# Altium project Tesla Coil.PrjPcb
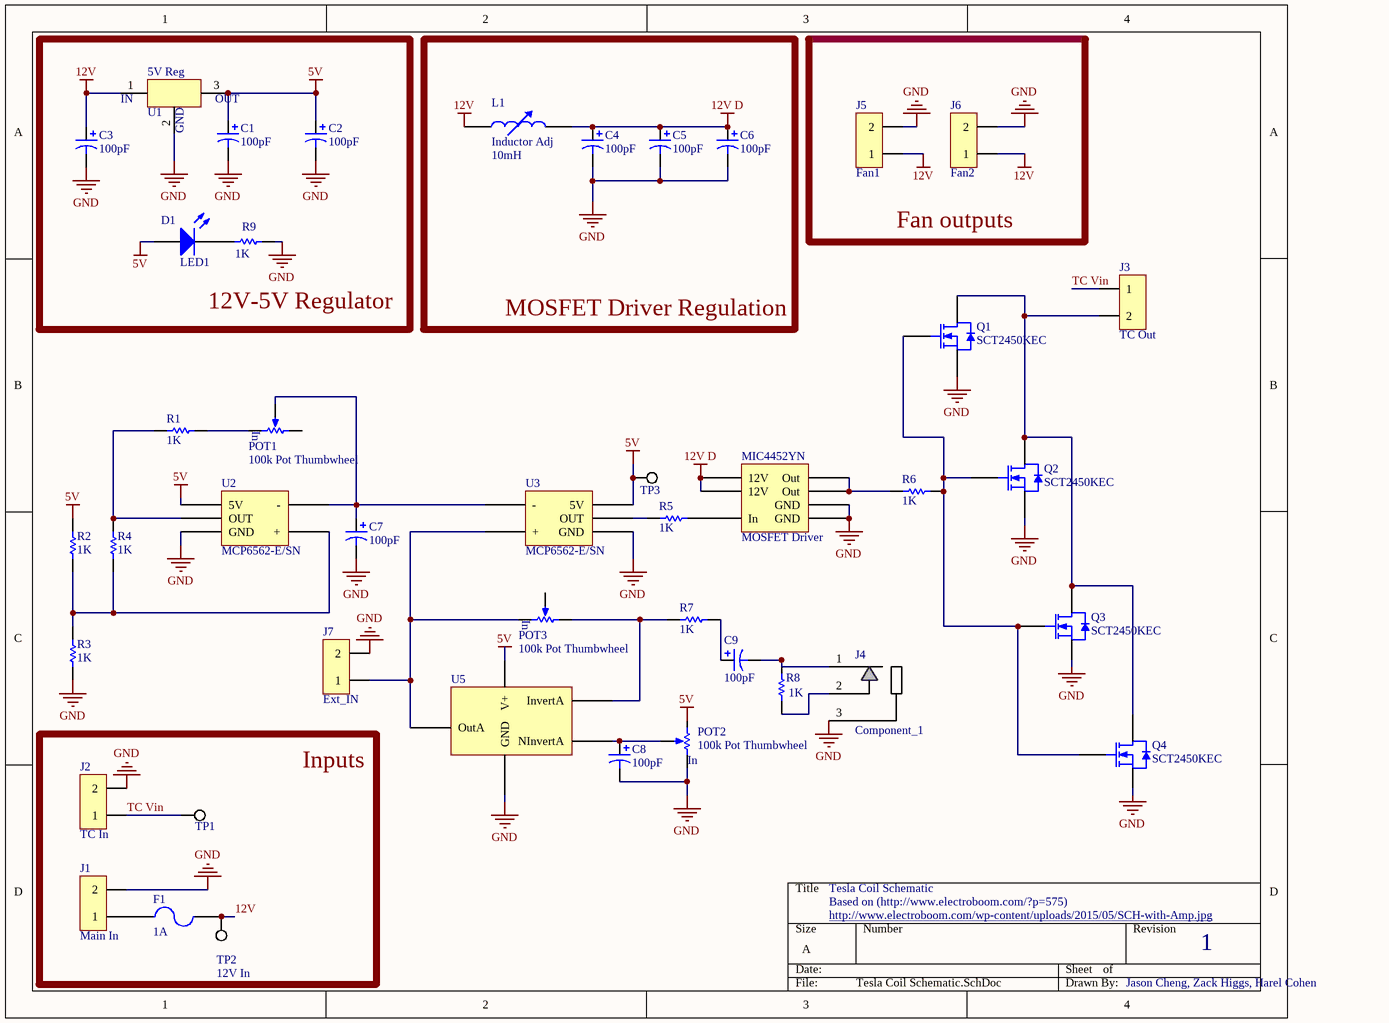
[diagram p0: Tesla Coil Schematic.SchDoc]
1 sheet, 43 parts. Net scope: global (net labels, ports and power ports of the same name join across sheets).
Board file: Tesla Coil PCB.PcbDoc

## Sheet Tesla Coil Schematic.SchDoc
size A

### Parts
C1  value 100pF  [CAPPR5-10X30]  (hidden comment: Cap 5-10x30)
C2  value 100pF  [CAPPR5-10X30]  (hidden comment: Cap 5-10x30)
C3  value 100pF  [CAPPR5-10X30]  (hidden comment: Cap 5-10x30)
C4  value 100pF  [CAPPR5-10X30]  (hidden comment: Cap 5-10x30)
C5  value 100pF  [CAPPR5-10X30]  (hidden comment: Cap 5-10x30)
C6  value 100pF  [CAPPR5-10X30]  (hidden comment: Cap 5-10x30)
C7  value 100pF  [CAPPR2-5X11]  (hidden comment: Cap 2-5x11)
C8  value 100pF  [CAPPR2-5X11]  (hidden comment: Cap 2-5x11)
C9  value 100pF  [CAPPR5-10X30]  (hidden comment: Cap 5-10x30)
D1  LED1  [LED-1]
F1  1A  [Blade Fuse]
J1  Main In  [Mini-Fit Jr. 2]
J2  TC In  [Mini-Fit Jr. 2]
J3  TC Out  [Mini-Fit Jr. 2]
J4  Component_1  [3.5Jack Foot]
J5  Fan1  [Mini-Fit Jr. 2]
J6  Fan2  [Mini-Fit Jr. 2]
J7  Ext_IN  [Mini-Fit Jr. 2]
L1  Inductor Adj  value 10mH  [AXIAL-0.8]
MIC4452YN  MOSFET Driver  [MIC441/44]
POT1  100k Pot Thumbwheel  [10K Pot 3352T]
POT2  100k Pot Thumbwheel  [10K Pot 3352T]
POT3  100k Pot Thumbwheel  [10K Pot 3352T]
Q1  SCT2450KEC  [SCT2450KEC]
Q2  SCT2450KEC  [SCT2450KEC]
Q3  SCT2450KEC  [SCT2450KEC]
Q4  SCT2450KEC  [SCT2450KEC]
R1  value 1K  [RES10.55-7X2.8]  (hidden comment: R Thru Hole)
R2  value 1K  [RES10.55-7X2.8]  (hidden comment: R Thru Hole)
R3  value 1K  [RES10.55-7X2.8]  (hidden comment: R Thru Hole)
R4  value 1K  [RES10.55-7X2.8]  (hidden comment: R Thru Hole)
R5  value 1K  [RES10.55-7X2.8]  (hidden comment: R Thru Hole)
R6  value 1K  [RES10.55-7X2.8]  (hidden comment: R Thru Hole)
R7  value 1K  [RES10.55-7X2.8]  (hidden comment: R Thru Hole)
R8  value 1K  [RES10.55-7X2.8]  (hidden comment: R Thru Hole)
R9  value 1K  [RES10.55-7X2.8]  (hidden comment: R Thru Hole)
TP1  Test Point  [Test Point]  (value not drawn)
TP2  Label: 12V In  [Test Point]  (hidden comment: Test Point)
TP3  Test Point  [Test Point]  (value not drawn)
U1  REG  [5V REG]  (value not drawn)
U2  MCP6562-E/SN  [MCP6562]
U3  MCP6562-E/SN  [MCP6562]
U5  LM358 (DIP Socket)  [3M5473-ND-]  (value not drawn)

### Blocks framed on the sheet
12V-5V Regulator: C1-C3 D1 R9 U1
MOSFET Driver Regulation: C4-C6 L1
Inputs: F1 J1 J2 TP1 TP2

### Nets
5V: C1.1 C2.1 D1.1(A) R2.2 TP3.1 U1.3 U2.5(5V) U3.8(5V) U5.8(V+)
12V: C3.1 F1.2 J5.1 J6.1 L1.1 TP2.1 U1.1
12V D: C4.1 C5.1 C6.1 L1.2 MIC4452YN.1(12V) MIC4452YN.8(12V)
GND: C1.2 C2.2 C3.2 C4.2 C5.2 C6.2 C7.2 C8.2 J1.2 J2.2 J4.3 J5.2 J6.2 J7.2 MIC4452YN.5(GND) MIC4452YN.6(GND) POT2.1(In) Q1.3 Q2.3 Q3.3 Q4.3 R3.1 R9.1 U1.2 U2.2(GND) U3.4(GND) U5.4(GND)
TC Vin: J2.1 J3.1 TP1.1
NetC7_1: C7.1 POT1.2(TAP) U2.4(-) U3.2(-)
NetC8_1: C8.1 POT2.2(TAP) U5.3(NInvertA)
NetC9_1: C9.1 R7.2
NetC9_2: C9.2 J4.1 R8.2
NetD1_2: D1.2(K) R9.2
NetF1_1: F1.1 J1.1
NetJ3_2: J3.2 Q1.2 Q2.2 Q3.2 Q4.2
NetJ4_2: J4.2 R8.1
NetJ7_1: J7.1 POT3.1(In) U3.3(+) U5.1(OutA)
NetMIC4452YN_2: MIC4452YN.2(In) R5.2
NetMIC4452YN_6: MIC4452YN.6(Out) MIC4452YN.7(Out) R6.1
NetPOT1_1: POT1.1(In) R1.2
NetPOT3_3: POT3.3(TOP) R7.1 U5.2(InvertA)
NetQ1_1: Q1.1 Q2.1 Q3.1 Q4.1 R6.2
NetR1_1: R1.1 R4.2 U2.1(OUT)
NetR2_1: R2.1 R3.2 R4.1 U2.3(+)
NetR5_1: R5.1 U3.1(OUT)

Not connected (* = marked no-connect by the designer): POT1 3(TOP); POT2 3(TOP); POT3 2(TAP)

### Notes on the sheet
- Fan outputs
- Tesla Coil Schematic
- Based on (http://www.electroboom.com/?p=575)
- http://www.electroboom.com/wp-content/uploads/2015/05/SCH-with-Amp.jpg
- 1
- Jason Cheng, Zack Higgs, Harel Cohen
- Labels drawn without touching a wire or pin: 5V
- (in symbol REG) 5V Reg; IN; OUT; GND

### Library data of the parts
C1-C6 C9 = Cap 5-10x30: Cap, Gen, 5-10x30; Published: 8-Jun-2000; LatestRevisionDate: 17-Jul-2002; LatestRevisionNote: Re-released for DXP Platform.; Publisher: Altium Limited
C7 C8 = Cap 2-5x11: Cap, Gen, 2-5x11; Published: 8-Jun-2000; LatestRevisionDate: 17-Jul-2002; LatestRevisionNote: Re-released for DXP Platform.; Publisher: Altium Limited
D1 = LED1: Typical RED GaAs LED; Published: 8-Jun-2000; LatestRevisionDate: 08-Jul-2005; LatestRevisionNote: Mech Layer 1 removed.; PackageReference: LED-1; Publisher: Altium Limited
F1 = Fuse 2: Fuse; Published: 8-Jun-2000; LatestRevisionDate: 17-Jul-2002; LatestRevisionNote: Re-released for DXP Platform.; PackageReference: PIN-W2/E2.8; Publisher: Altium Limited; PackageDescription: Thru-Hole; 2 Leads
J1-J3 J5-J7 = Mini-Fit Jr. 2-pin: Mini-Fit Jr. 2-pin Right Angle; Manufacturer: Molex Inc; Manufacturer Part Number: 0039300020; Connector Type: Header, Shrouded; Number of Positions: 2; Number of Positions Loaded: All; Row Spacing: 0.165" (4.20mm); Ordering: http://search.digikey.com/scripts/DkSearch/dksus.dll?Detail&name=WM1351-ND; Datasheet: http://www.molex.com/pdm_docs/sd/039301020_sd.pdf; Supplier 1: Digi-Key; RoHS: RoHS Compliant; Category: Connectors, Interconnects; Stock 1: 371; Pricing 1: 1=0.77, 10=0.674, 50=0.6078, 100=0.5815, 250=0.5286, 500=0.47574, 1000=0.42288, 2500=0.38324, 5000=0.37002 (USD); Contact Type: Male Pin; Pitch: -; Number of Rows: 2; Contact Mating Length: -; Mounting Type: Through Hole, Right Angle; Termination: Solder; Fastening Type: Locking Ramp; Features: Board Lock; Contact Finish: Tin; Contact Finish Thickness: 200µin (5.08µm); Color: Natural; Packaging: Tray; ComponentLink1URL: http://www.molex.com/pdm_docs/sd/039300020_sd.pdf; ComponentLink1Description: http://www.molex.com/pdm_docs/sd/039300020_sd.pdf; Supplier Part Number 1: WM21351-ND
L1 = Inductor Adj: Adjustable Inductor; Set Position: 0.5; Published: 24-Mar-1999; LatestRevisionDate: 17-Jul-2002; LatestRevisionNote: Re-released for DXP Platform.; PackageReference: AXIAL-0.8; Publisher: Altium Limited
R1-R9 = R Thru Hole: R, Gen, Thru Hole; Published: 8-Jun-2000; LatestRevisionDate: 17-Jul-2002; LatestRevisionNote: Re-released for DXP Platform.; Publisher: Altium Limited
U2 = MCP6562-E/SN: pin to pad: 2>4 4>2 5>8